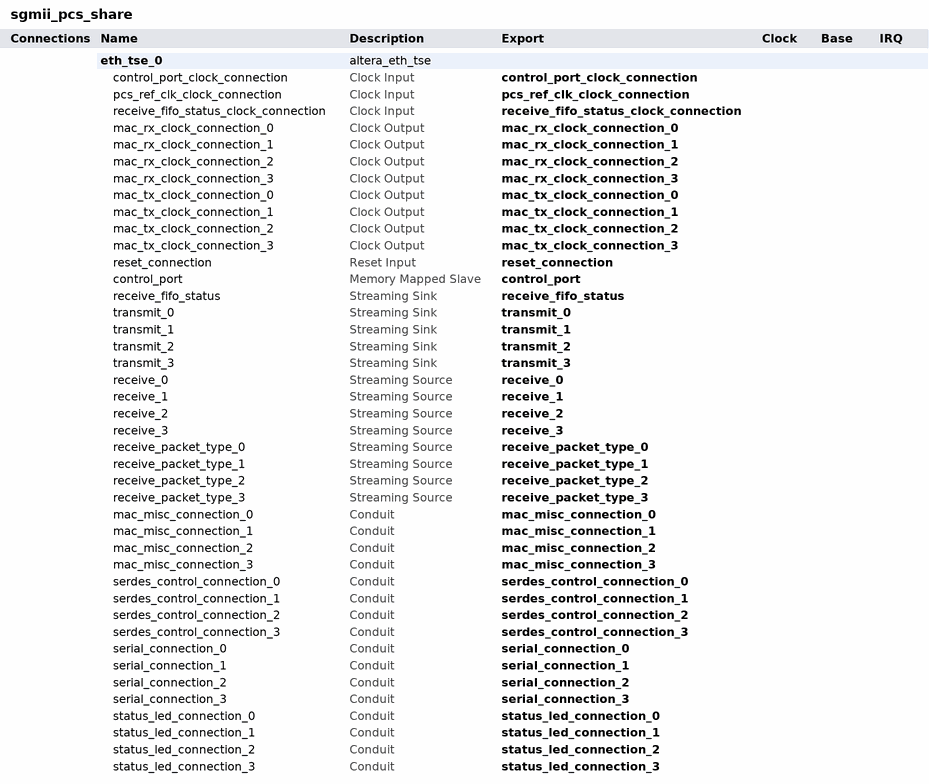
[diagram p0: system contents]
# Platform Designer (Qsys) system sgmii_pcs_share, Arria 10 10AX048H2F34I2SG
# Parameters at their usual value, and those the tool derives, are not listed.
package require -exact qsys 19.1
create_system sgmii_pcs_share
set_project_property DEVICE_FAMILY {Arria 10}
set_project_property DEVICE 10AX048H2F34I2SG

add_instance eth_tse_0 altera_eth_tse 19.1
set_instance_property eth_tse_0 AUTO_EXPORT true
set_instance_parameter_value eth_tse_0 XCVR_RCFG_JTAG_ENABLE 0
set_instance_parameter_value eth_tse_0 XCVR_SET_CAPABILITY_REG_ENABLE 0
set_instance_parameter_value eth_tse_0 XCVR_SET_CSR_SOFT_LOGIC_ENABLE 0
set_instance_parameter_value eth_tse_0 XCVR_SET_PRBS_SOFT_LOGIC_ENABLE 0
set_instance_parameter_value eth_tse_0 XCVR_SET_USER_IDENTIFIER 0
set_instance_parameter_value eth_tse_0 core_variation MAC_PCS
set_instance_parameter_value eth_tse_0 enable_hd_logic false
set_instance_parameter_value eth_tse_0 enable_mac_flow_ctrl false
set_instance_parameter_value eth_tse_0 enable_magic_detect true
set_instance_parameter_value eth_tse_0 enable_shift16 false
set_instance_parameter_value eth_tse_0 enable_use_internal_fifo false
set_instance_parameter_value eth_tse_0 ifGMII MII_GMII
set_instance_parameter_value eth_tse_0 ing_addr 11
set_instance_parameter_value eth_tse_0 max_channels 4
set_instance_parameter_value eth_tse_0 mdio_clk_div 40
set_instance_parameter_value eth_tse_0 stat_cnt_ena false
set_instance_parameter_value eth_tse_0 transceiver_type LVDS_IO
set_instance_parameter_value eth_tse_0 useMDIO false

# exported interfaces
add_interface control_port avalon slave
set_interface_property control_port EXPORT_OF eth_tse_0.control_port
add_interface control_port_clock_connection clock sink
set_interface_property control_port_clock_connection EXPORT_OF eth_tse_0.control_port_clock_connection
add_interface mac_misc_connection_0 conduit end
set_interface_property mac_misc_connection_0 EXPORT_OF eth_tse_0.mac_misc_connection_0
add_interface mac_misc_connection_1 conduit end
set_interface_property mac_misc_connection_1 EXPORT_OF eth_tse_0.mac_misc_connection_1
add_interface mac_misc_connection_2 conduit end
set_interface_property mac_misc_connection_2 EXPORT_OF eth_tse_0.mac_misc_connection_2
add_interface mac_misc_connection_3 conduit end
set_interface_property mac_misc_connection_3 EXPORT_OF eth_tse_0.mac_misc_connection_3
add_interface mac_rx_clock_connection_0 clock source
set_interface_property mac_rx_clock_connection_0 EXPORT_OF eth_tse_0.mac_rx_clock_connection_0
add_interface mac_rx_clock_connection_1 clock source
set_interface_property mac_rx_clock_connection_1 EXPORT_OF eth_tse_0.mac_rx_clock_connection_1
add_interface mac_rx_clock_connection_2 clock source
set_interface_property mac_rx_clock_connection_2 EXPORT_OF eth_tse_0.mac_rx_clock_connection_2
add_interface mac_rx_clock_connection_3 clock source
set_interface_property mac_rx_clock_connection_3 EXPORT_OF eth_tse_0.mac_rx_clock_connection_3
add_interface mac_tx_clock_connection_0 clock source
set_interface_property mac_tx_clock_connection_0 EXPORT_OF eth_tse_0.mac_tx_clock_connection_0
add_interface mac_tx_clock_connection_1 clock source
set_interface_property mac_tx_clock_connection_1 EXPORT_OF eth_tse_0.mac_tx_clock_connection_1
add_interface mac_tx_clock_connection_2 clock source
set_interface_property mac_tx_clock_connection_2 EXPORT_OF eth_tse_0.mac_tx_clock_connection_2
add_interface mac_tx_clock_connection_3 clock source
set_interface_property mac_tx_clock_connection_3 EXPORT_OF eth_tse_0.mac_tx_clock_connection_3
add_interface pcs_ref_clk_clock_connection clock sink
set_interface_property pcs_ref_clk_clock_connection EXPORT_OF eth_tse_0.pcs_ref_clk_clock_connection
add_interface receive_0 avalon_streaming source
set_interface_property receive_0 EXPORT_OF eth_tse_0.receive_0
add_interface receive_1 avalon_streaming source
set_interface_property receive_1 EXPORT_OF eth_tse_0.receive_1
add_interface receive_2 avalon_streaming source
set_interface_property receive_2 EXPORT_OF eth_tse_0.receive_2
add_interface receive_3 avalon_streaming source
set_interface_property receive_3 EXPORT_OF eth_tse_0.receive_3
add_interface receive_fifo_status avalon_streaming sink
set_interface_property receive_fifo_status EXPORT_OF eth_tse_0.receive_fifo_status
add_interface receive_fifo_status_clock_connection clock sink
set_interface_property receive_fifo_status_clock_connection EXPORT_OF eth_tse_0.receive_fifo_status_clock_connection
add_interface receive_packet_type_0 avalon_streaming source
set_interface_property receive_packet_type_0 EXPORT_OF eth_tse_0.receive_packet_type_0
add_interface receive_packet_type_1 avalon_streaming source
set_interface_property receive_packet_type_1 EXPORT_OF eth_tse_0.receive_packet_type_1
add_interface receive_packet_type_2 avalon_streaming source
set_interface_property receive_packet_type_2 EXPORT_OF eth_tse_0.receive_packet_type_2
add_interface receive_packet_type_3 avalon_streaming source
set_interface_property receive_packet_type_3 EXPORT_OF eth_tse_0.receive_packet_type_3
add_interface reset_connection reset sink
set_interface_property reset_connection EXPORT_OF eth_tse_0.reset_connection
add_interface serdes_control_connection_0 conduit end
set_interface_property serdes_control_connection_0 EXPORT_OF eth_tse_0.serdes_control_connection_0
add_interface serdes_control_connection_1 conduit end
set_interface_property serdes_control_connection_1 EXPORT_OF eth_tse_0.serdes_control_connection_1
add_interface serdes_control_connection_2 conduit end
set_interface_property serdes_control_connection_2 EXPORT_OF eth_tse_0.serdes_control_connection_2
add_interface serdes_control_connection_3 conduit end
set_interface_property serdes_control_connection_3 EXPORT_OF eth_tse_0.serdes_control_connection_3
add_interface serial_connection_0 conduit end
set_interface_property serial_connection_0 EXPORT_OF eth_tse_0.serial_connection_0
add_interface serial_connection_1 conduit end
set_interface_property serial_connection_1 EXPORT_OF eth_tse_0.serial_connection_1
add_interface serial_connection_2 conduit end
set_interface_property serial_connection_2 EXPORT_OF eth_tse_0.serial_connection_2
add_interface serial_connection_3 conduit end
set_interface_property serial_connection_3 EXPORT_OF eth_tse_0.serial_connection_3
add_interface status_led_connection_0 conduit end
set_interface_property status_led_connection_0 EXPORT_OF eth_tse_0.status_led_connection_0
add_interface status_led_connection_1 conduit end
set_interface_property status_led_connection_1 EXPORT_OF eth_tse_0.status_led_connection_1
add_interface status_led_connection_2 conduit end
set_interface_property status_led_connection_2 EXPORT_OF eth_tse_0.status_led_connection_2
add_interface status_led_connection_3 conduit end
set_interface_property status_led_connection_3 EXPORT_OF eth_tse_0.status_led_connection_3
add_interface transmit_0 avalon_streaming sink
set_interface_property transmit_0 EXPORT_OF eth_tse_0.transmit_0
add_interface transmit_1 avalon_streaming sink
set_interface_property transmit_1 EXPORT_OF eth_tse_0.transmit_1
add_interface transmit_2 avalon_streaming sink
set_interface_property transmit_2 EXPORT_OF eth_tse_0.transmit_2
add_interface transmit_3 avalon_streaming sink
set_interface_property transmit_3 EXPORT_OF eth_tse_0.transmit_3

set_interconnect_requirement {$system} qsys_mm.clockCrossingAdapter HANDSHAKE
set_interconnect_requirement {$system} qsys_mm.enableEccProtection FALSE
set_interconnect_requirement {$system} qsys_mm.insertDefaultSlave FALSE
set_interconnect_requirement {$system} qsys_mm.maxAdditionalLatency 1

save_system sgmii_pcs_share.qsys
